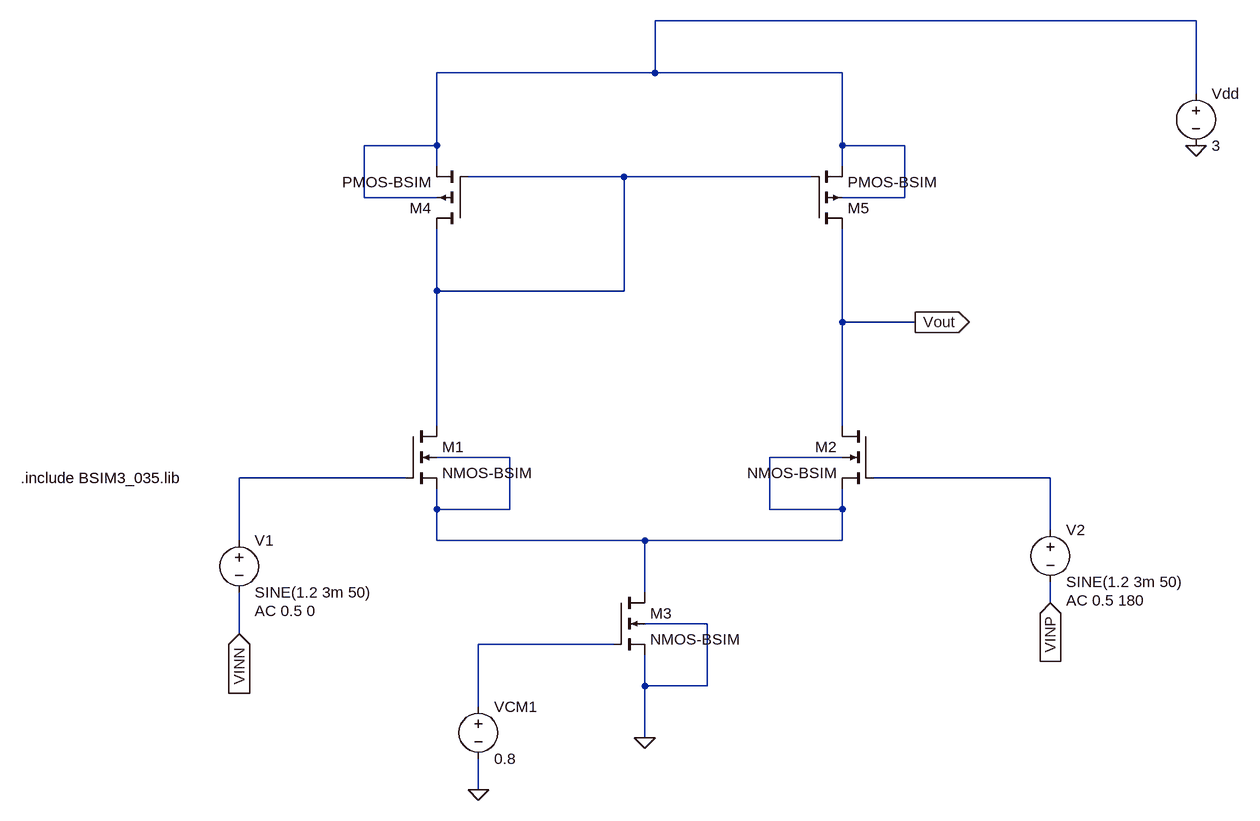
[diagram p0: schematic diff_opamp.asc]
diff_opamp.asc, the LTspice schematic file:
Version 4
SHEET 1 1336 772
WIRE 1264 -432 432 -432
WIRE 432 -352 432 -432
WIRE 432 -352 96 -352
WIRE 720 -352 432 -352
WIRE 1264 -320 1264 -432
WIRE 96 -240 96 -352
WIRE 96 -240 -16 -240
WIRE 720 -240 720 -352
WIRE 816 -240 720 -240
WIRE 96 -208 96 -240
WIRE 720 -208 720 -240
WIRE 384 -192 144 -192
WIRE 672 -192 384 -192
WIRE -16 -160 -16 -240
WIRE 96 -160 -16 -160
WIRE 816 -160 816 -240
WIRE 816 -160 720 -160
WIRE 96 -16 96 -112
WIRE 384 -16 384 -192
WIRE 384 -16 96 -16
WIRE 720 32 720 -112
WIRE 832 32 720 32
WIRE 96 192 96 -16
WIRE 720 192 720 32
WIRE 208 240 96 240
WIRE 720 240 608 240
WIRE 48 272 -208 272
WIRE 1040 272 768 272
WIRE 96 320 96 288
WIRE 208 320 208 240
WIRE 208 320 96 320
WIRE 608 320 608 240
WIRE 720 320 720 288
WIRE 720 320 608 320
WIRE 1040 352 1040 272
WIRE -208 368 -208 272
WIRE 96 368 96 320
WIRE 416 368 96 368
WIRE 720 368 720 320
WIRE 720 368 416 368
WIRE 416 448 416 368
WIRE 1040 464 1040 432
WIRE 512 496 416 496
WIRE -208 512 -208 448
WIRE 368 528 160 528
WIRE 416 592 416 544
WIRE 512 592 512 496
WIRE 512 592 416 592
WIRE 160 624 160 528
WIRE 416 672 416 592
WIRE 160 752 160 704
FLAG 160 752 0
FLAG 416 672 0
FLAG 1264 -240 0
FLAG 832 32 Vout
IOPIN 832 32 Out
FLAG -208 512 VINN
IOPIN -208 512 In
FLAG 1040 464 VINP
IOPIN 1040 464 In
SYMBOL nmos4 48 192 R0
SYMATTR InstName M1
SYMATTR Value NMOS-BSIM
SYMATTR Value2 l=1.5u w=500u
SYMBOL nmos4 768 192 M0
SYMATTR InstName M2
SYMATTR Value NMOS-BSIM
SYMATTR Value2 l=1.5u w=500u
SYMBOL nmos4 368 448 R0
SYMATTR InstName M3
SYMATTR Value NMOS-BSIM
SYMATTR Value2 l=11u w=600u
SYMBOL pmos4 144 -112 R180
SYMATTR InstName M4
SYMATTR Value PMOS-BSIM
SYMATTR Value2 l=4u w=700u
SYMBOL pmos4 672 -112 M180
SYMATTR InstName M5
SYMATTR Value PMOS-BSIM
SYMATTR Value2 l=4u w=700u
SYMBOL voltage 160 608 R0
WINDOW 123 0 0 Left 0
WINDOW 39 0 0 Left 0
SYMATTR InstName VCM1
SYMATTR Value 0.8
SYMBOL voltage 1264 -336 R0
WINDOW 123 0 0 Left 0
WINDOW 39 0 0 Left 0
SYMATTR InstName Vdd
SYMATTR Value 3
SYMBOL voltage -208 352 R0
WINDOW 123 24 124 Left 2
WINDOW 39 0 0 Left 0
SYMATTR InstName V1
SYMATTR Value SINE(1.2 3m 50)
SYMATTR Value2 AC 0.5 0
SYMBOL voltage 1040 336 R0
WINDOW 123 24 124 Left 2
WINDOW 39 0 0 Left 0
SYMATTR InstName V2
SYMATTR Value SINE(1.2 3m 50)
SYMATTR Value2 AC 0.5 180
TEXT -544 272 Left 2 !.include BSIM3_035.lib

The netlist it stands for:
* diff_opamp.asc
M1 N002 N004 N003 N003 NMOS-BSIM l=1.5u w=500u
M2 Vout N005 N003 N003 NMOS-BSIM l=1.5u w=500u
M3 N003 N006 0 0 NMOS-BSIM l=11u w=600u
M4 N002 N002 N001 N001 PMOS-BSIM l=4u w=700u
M5 Vout N002 N001 N001 PMOS-BSIM l=4u w=700u
VCM1 N006 0 0.8
Vdd N001 0 3
V1 N004 VINN SINE(1.2 3m 50) AC 0.5 0
V2 N005 VINP SINE(1.2 3m 50) AC 0.5 180
.model NMOS NMOS
.model PMOS PMOS
.lib standard.mos
.include BSIM3_035.lib
.backanno
.end